# Altium schematic sheet Voltage Regulator.SchDoc
size A
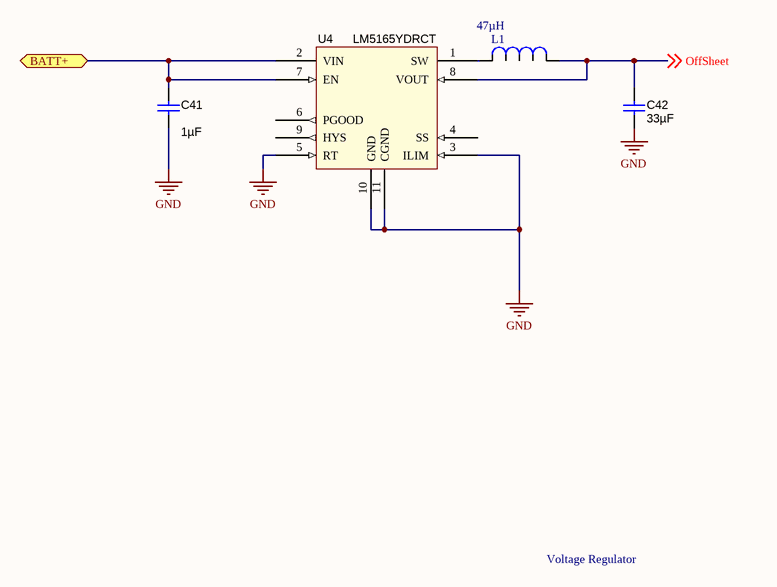
[diagram p0: Voltage Regulator.SchDoc]

## Parts
C41  ValueDisplayed: 1µF  [CAP 0805/2012]  (hidden comment: CGA4J3X7S2A105M125AB)
C42  ValueDisplayed: 33µF  [CAP 0805/2012]  (hidden comment: C2012X5R0J336M125AC)
L1  ValueDisplayed: 47µH  [IND NR4018T470M]  (hidden comment: NR4018T470M)
U4  LM5165YDRCT  [SON50P300X100_HS-11N]

## Ports
BATT+

## Nets
GND: C41.2 C42.2 U4.3(ILIM) U4.5(RT) U4.10(GND) U4.11(CGND)
BATT+: C41.1 U4.2(VIN) U4.7(EN) ; port BATT+
OffSheet: C42.1 L1.1 U4.8(VOUT) ; off-sheet OffSheet
NetL1_2: L1.2 U4.1(SW)

Not connected (* = marked no-connect by the designer): U4 4(SS) 6(PGOOD) 9(HYS)

## Notes on the sheet
- Voltage Regulator

## Library data of the parts
C41 = CGA4J3X7S2A105M125AB: CAP CER 1UF 100V X7S 0805; Manufacturer: TDK Corporation; Polarized: N; CompType: Capacitor; U/M: EA; Cap_F: 0.000001; Tolerance_%: 20; Value1: Unknown; VDC_V: 100; TempCo: X7R; TaMin_C: -55; TaMax_C: 125; Cap_Case: 0805; SizeArea_mm2: 5.12; SizeAreaWB_mm2: 14.7; SizeX_mm: 3.2; SizeY_mm: 1.6; SizeZ_mm: 2.7; AEC Category: Q200; AEC Qualified: y; SymbolVersion: 2008-07-09; Value: 1uF; PartNumber: CGA4J3X7S2A105M125AB; PackageReference: 0805; RoHS: Y; Value2: 100V; MountType: SMT; Technology: Ceramic; Published: 2008-06-19; Publisher: Texas Instruments; LatestRevisionDate: 2016-06-14; ComponentLink1Description: Datasheet link; ComponentLink1URL: https://product.tdk.com/info/en/documents/chara_sheet/CGA4J3X7S2A105M125AB.pdf
C42 = C2012X5R0J336M125AC: CAP CER 33UF 6.3V X5R 0805; Manufacturer: TDK Corporation; Polarized: N; CompType: Capacitor; U/M: EA; Cap_F: 0.000033; Tolerance_%: 20; Value1: Unknown; VDC_V: 6.3; TaMin_C: -55; TaMax_C: 125; Cap_Case: 0805; SizeArea_mm2: 5.12; SizeAreaWB_mm2: 14.7; SizeX_mm: 3.2; SizeY_mm: 1.6; SizeZ_mm: 2.7; AEC Qualified: Y; SymbolVersion: 2008-07-09; Value: 33uF; PartNumber: C2012X5R0J336M125AC; PackageReference: 0805; RoHS: Y; Value2: 6.3V; MountType: SMT; Technology: Ceramic; TempCo: X5R; ComponentLink1Description: Datasheet link; ComponentLink1URL: https://product.tdk.com/info/en/documents/chara_sheet/C2012X5R0J336M125AC.pdf; Supplier 1: Mouser; Supplier 2: Digi-Key; Supplier Part Number 1: 810-C2012X5R0J336M; Supplier Part Number 2: 445-5986-1-ND
L1 = NR4018T470M: INDUCTOR 47u HENRY 20%; Manufacturer: Taiyo Yuden; SizeX_mm: 4.0; SizeZ_mm: 1.8; TaMax_C: 125; TaMin_C: -55; TempCo: X7R; Tolerance_%: 20; U/M: EA; Value: 47µH; ComponentLink1Description: Datasheet link; ComponentLink1URL: http://ds.yuden.co.jp/TYCOMPAS/ut/detail.do?productNo=NR4018T470M&fileName=NR4018T470M_SS&mode=specSheetDownload; CompType: Inductor; LatestRevisionDate: 2016-07-21; MountType: SMD; PartNumber: NR4018T470M; RoHS: Y; SizeY_mm: 4.0; Technology: Ceramic
U4 = LM5165YDRCT: IC REG BUCK 3.3V 0.15A 10VSON; Manufacturer: Texas Instruments; SymbolCreator: x0208325; U/M: EA; SymbolVersion: 2013-11-18; PartNumber: LM5165YDRCT; PackageReference: 10-VSON; MountType: SMT; ComponentLink1Description: Datasheet Link; ComponentLink1URL: http://www.ti.com/lit/ds/symlink/lm5165.pdf; CompType: IC; RoHS: Y; Publisher: Texas Instruments; LatestRevisionDate: 2016-04-08; Supplier 1: Mouser; Supplier 2: Digi-Key; Supplier Part Number 1: 595-LM5165YDRCT; Supplier Part Number 2: 296-44069-1-ND